# EAGLE design DC-DC Converter v1.1 (EAGLE 5.12)

## Sheet 1 of 3
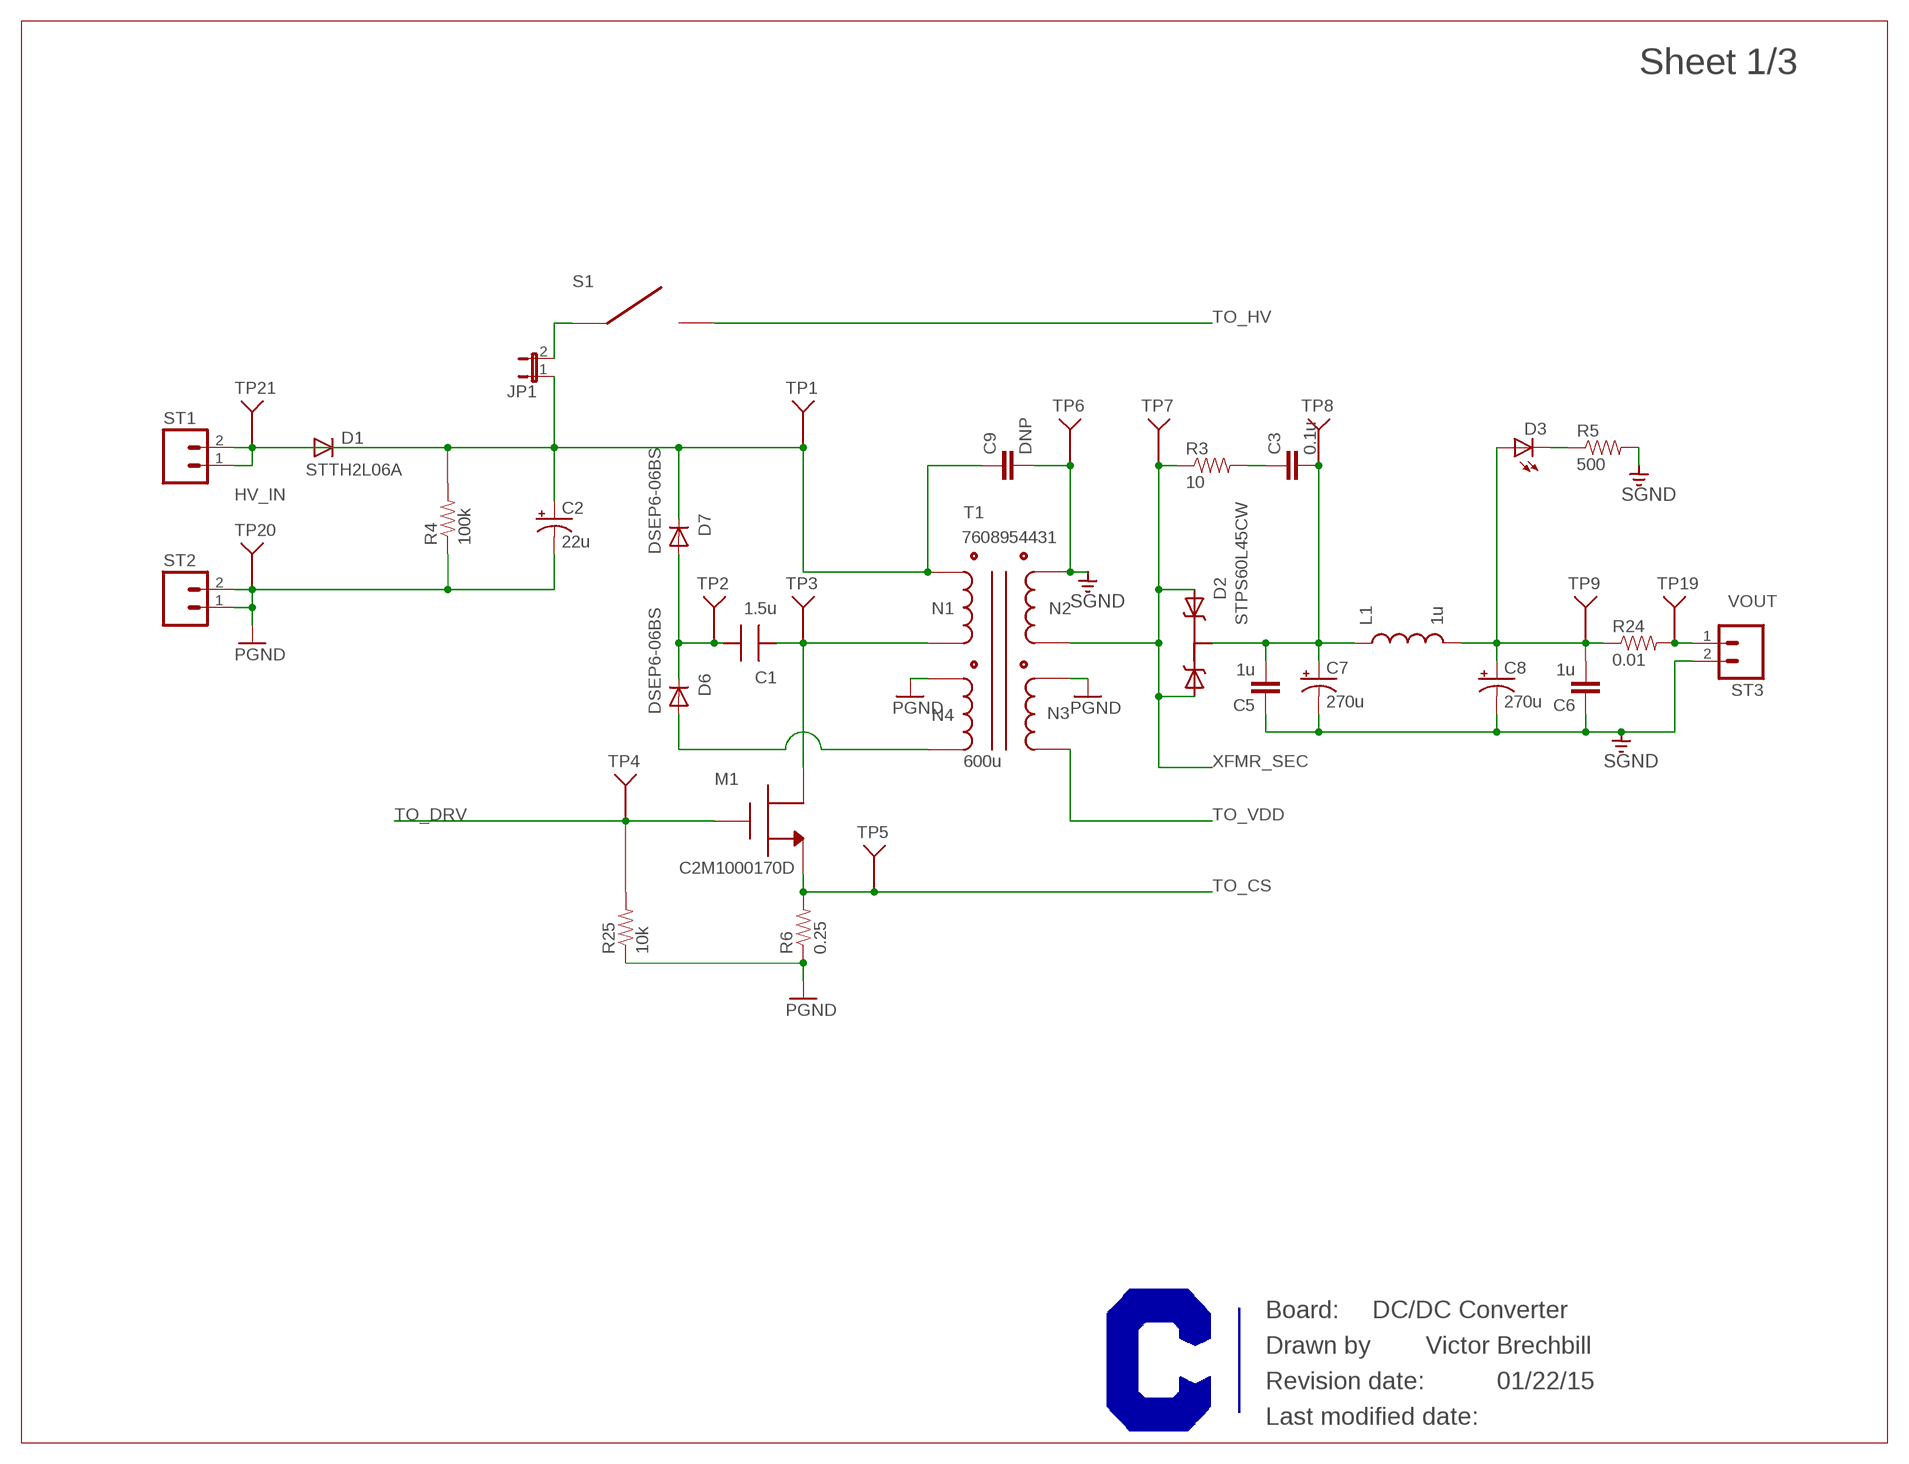
[diagram p0: schematic, sheet 1]

### Parts
C1  1.5u  CAP_CKG57XXX  [CKG_MEGACAP_57]
C2  22u  12.5MM_CAP  [12.5MM_CAP]
C3  0.1u  CAP0805  [0805]
C5  1u  CAP0805  [0805]
C6  1u  CAP0805  [0805]
C7  270u  8MM_CAP  [8MM_CAP]
C8  270u  8MM_CAP  [8MM_CAP]
C9  DNP  CAP0603-CAP  [0603-CAP]
D1  DIODEHV  [DIODE-HV]
D2  DUAL-DIODE_SINK  [T247_SINK]
D3  LEDCHIPLED_0805  [CHIPLED_0805]
D6  DIODESMB  [SMB-DIODE]
D7  DIODESMB  [SMB-DIODE]
JP1  JUMPER-2PTH  [1X02]
L1  1u  MCBF7330  [MCBF7330]
M1  N-MOSFET_SINK  [T247_SINK]
R3  10  RESISTOR2512  [R2512]
R4  100k  RESISTOR2512  [R2512]
R5  500  RESISTOR0603-RES  [0603-RES]
R6  0.25  RESISTOR1206  [1206]
R24  0.01  RESISTOR0805-RES  [0805]
R25  10k  RESISTOR2512  [R2512]
S1  SWITCH_15551  [15XXX]
ST1  M023.5MM-NO_SILK  [SCREWTERMINAL-3.5MM-2-NS]
ST2  M023.5MM-NO_SILK  [SCREWTERMINAL-3.5MM-2-NS]
ST3  M023.5MM-NO_SILK  [SCREWTERMINAL-3.5MM-2-NS]
T1  760895431  [ETD34]
TP1  TEST_POINT  [TEST_POINT]
TP2  TEST_POINT  [TEST_POINT]
TP3  TEST_POINT  [TEST_POINT]
TP4  TEST_POINT  [TEST_POINT]
TP5  TEST_POINT  [TEST_POINT]
TP6  TEST_POINT  [TEST_POINT]
TP7  TEST_POINT  [TEST_POINT]
TP8  TEST_POINT  [TEST_POINT]
TP9  TEST_POINT  [TEST_POINT]
TP19  TEST_POINT  [TEST_POINT]
TP20  TEST_POINT  [TEST_POINT]
TP21  TEST_POINT  [TEST_POINT]
U$2  CURRENT-C-LETTER-LANDSCAPE  [BLANK]

### Nets
D6: D3.C R5.1
FET_DRAIN: C1.P$1 M1.2(D) T1.P$2 TP3.P$1
FUSED: D1.A
HV_IN: ST1.1 ST1.2 TP21.P$1
N4: D6.A T1.P$6
OUT: R24.2 ST3.1 TP19.P$1
OUT_PREFILTER: C3.2 C5.2 C7.+ D2.2(OUT) L1.P$1 TP8.P$1
PGND: C2.- R4.1 R6.1 R25.1 ST2.1 ST2.2 T1.P$5 T1.P$9 TP20.P$1 ; also sheet 2
RVP_IN: C2.+ C9.1 D1.C D7.C JP1.1 R4.2 T1.P$4 TP1.P$1
SGND: C5.1 C6.1 C7.- C8.- C9.2 R5.2 ST3.2 T1.P$8 TP6.P$1 ; also sheet 3
SNUB_SEC: C3.1 R3.2
TO_CS: M1.3(S) R6.2 TP5.P$1 ; also sheet 2
TO_DRV: M1.1(G) R25.2 TP4.P$1 ; also sheet 2
TO_HV: S1.P$4 ; also sheet 2
TO_SW: JP1.2 S1.P$3
TO_VDD: T1.P$11 ; also sheet 2
V_SNUB: C1.P$2 D6.C D7.A TP2.P$1
VOUT: C6.2 C8.+ D3.A L1.P$2 R24.1 TP9.P$1 ; also sheet 3
XFMR_SEC: D2.1(IN_1) D2.3(IN_2) R3.1 T1.P$10 TP7.P$1 ; also sheet 3

### Notes on the sheet
- STTH2L06A
- 7608954431
- DSEP6-06BS
- STPS60L45CW
- DSEP6-06BS
- 600u
- C2M1000170D
- DC/DC Converter
- Victor Brechbill
- 01/22/15

## Sheet 2 of 3
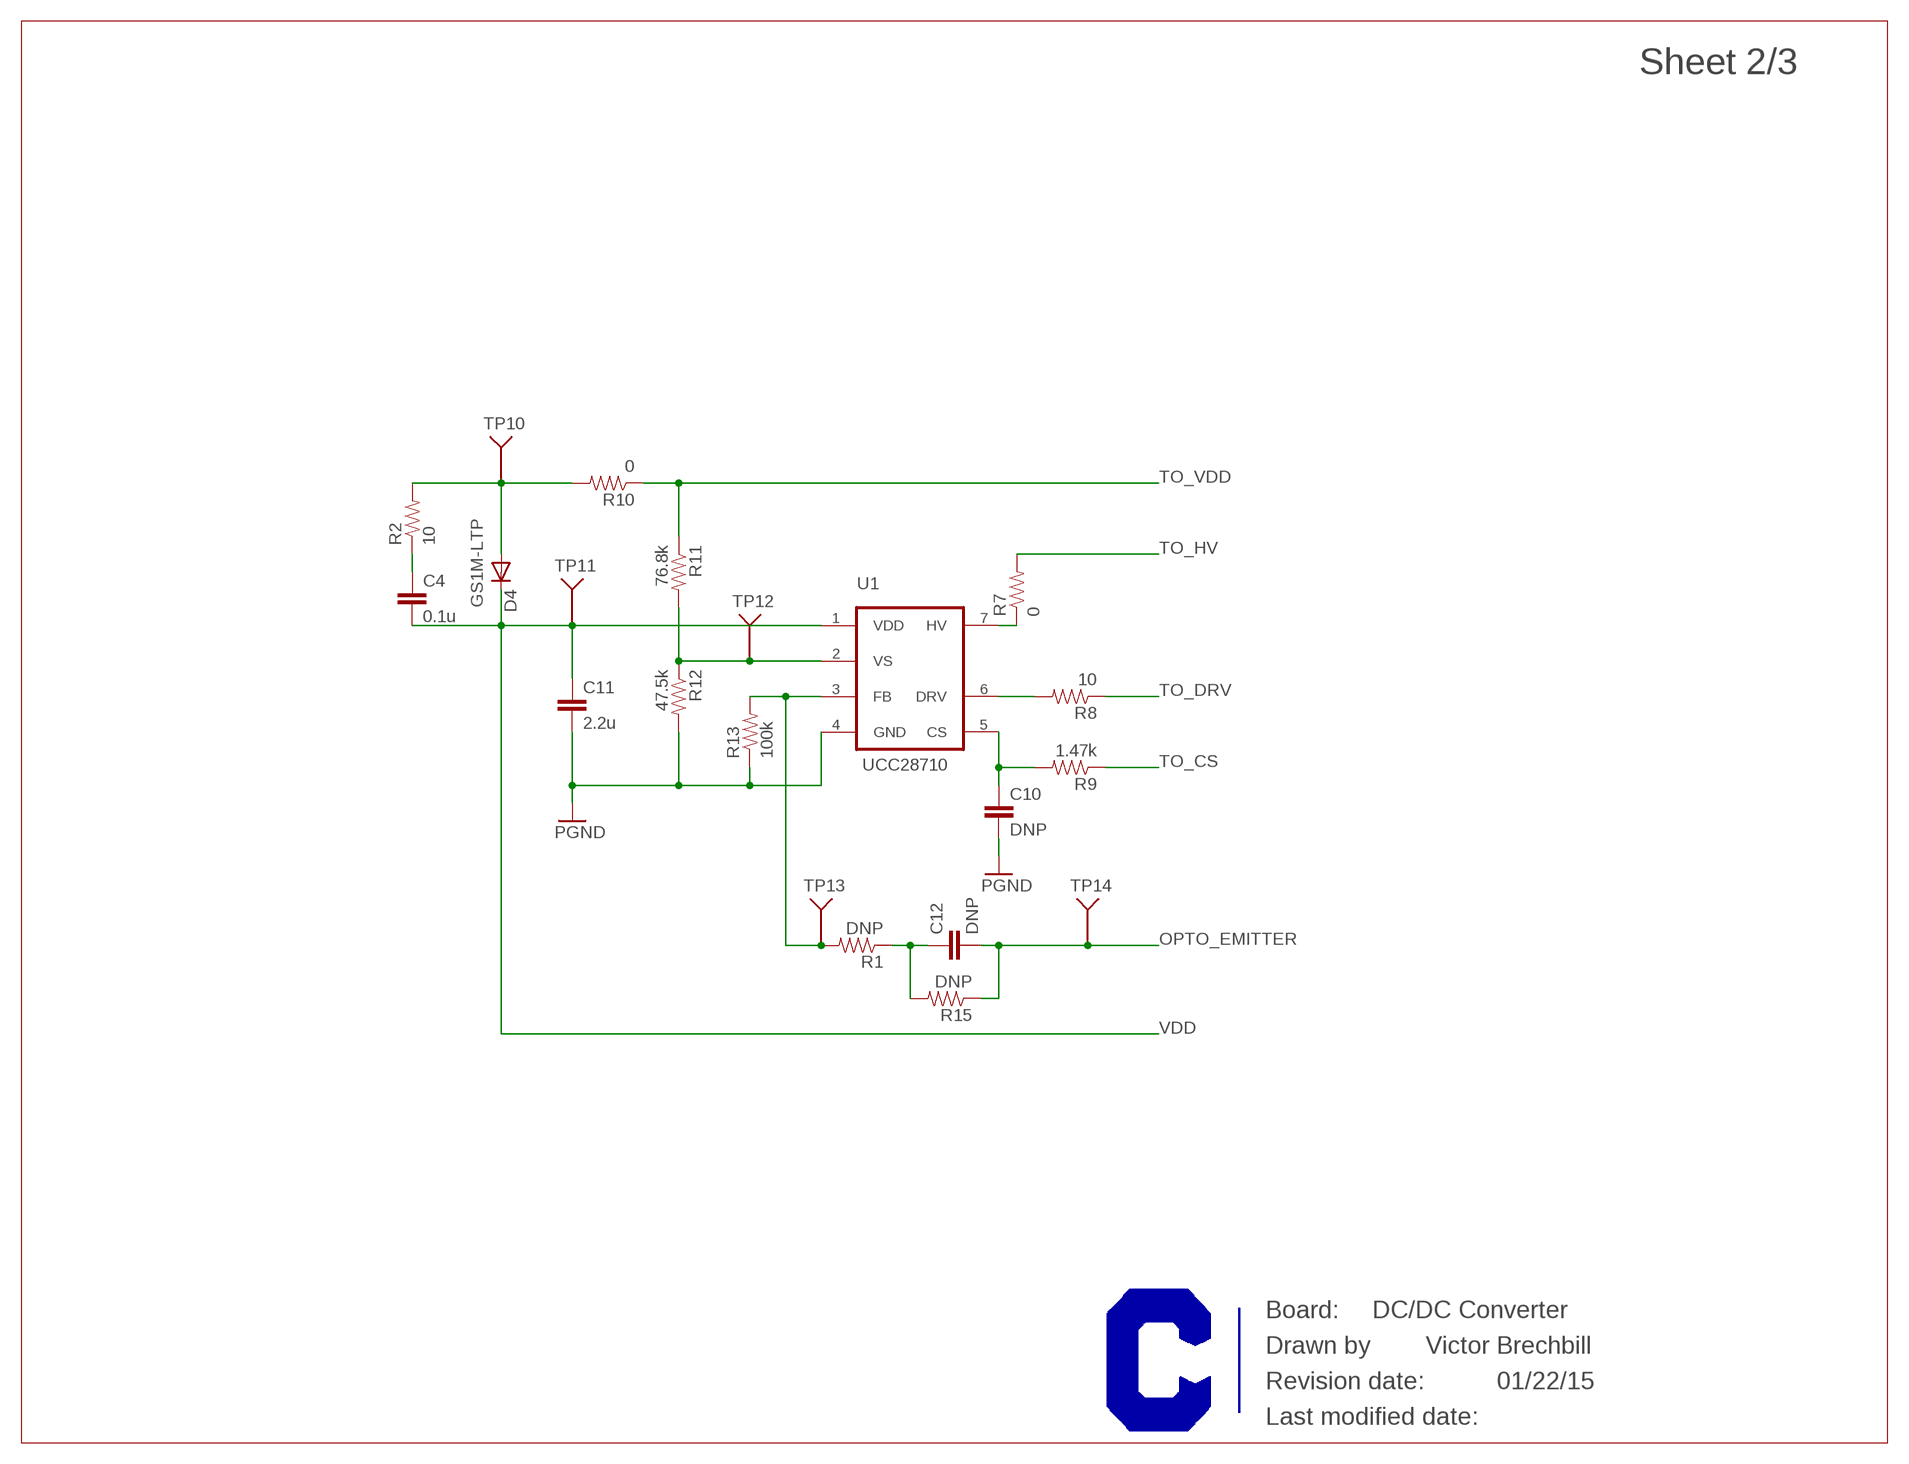
[diagram p1: schematic, sheet 2]

### Parts
C4  0.1u  CAP0805  [0805]
C10  DNP  CAP0603-CAP  [0603-CAP]
C11  2.2u  CAP0805  [0805]
C12  DNP  CAP0603-CAP  [0603-CAP]
D4  DIODESMA  [SMA-DIODE]
R1  DNP  RESISTOR0603-RES  [0603-RES]
R2  10  RESISTOR2512  [R2512]
R7  0  RESISTOR0805-RES  [0805]
R8  10  RESISTOR0805-RES  [0805]
R9  1.47k  RESISTOR0805-RES  [0805]
R10  0  RESISTOR0805-RES  [0805]
R11  76.8k  RESISTOR0805-RES  [0805]
R12  47.5k  RESISTOR0805-RES  [0805]
R13  100k  RESISTOR0603-RES  [0603-RES]
R15  DNP  RESISTOR0603-RES  [0603-RES]
TP10  TEST_POINT  [TEST_POINT]
TP11  TEST_POINT  [TEST_POINT]
TP12  TEST_POINT  [TEST_POINT]
TP13  TEST_POINT  [TEST_POINT]
TP14  TEST_POINT  [TEST_POINT]
U1  UCC28740  [SOIC-7]
U$3  CURRENT-C-LETTER-LANDSCAPE  [BLANK]

### Nets
CS: C10.1 R9.2 U1.5(CS)
DRV: R8.2 U1.6(DRV)
FB: R1.2 R13.2 TP13.P$1 U1.3(FB)
HV: R7.1 U1.7(HV)
N$5: C4.1 R2.1
N$6: D4.A R2.2 R10.2 TP10.P$1
N$9: C12.1 R1.1 R15.2
OPTO_EMITTER: C12.2 R15.1 TP14.P$1 ; also sheet 3
PGND: C10.2 C11.2 R12.2 R13.1 U1.4(GND) ; also sheet 1
TO_CS: R9.1 ; also sheet 1
TO_DRV: R8.1 ; also sheet 1
TO_HV: R7.2 ; also sheet 1
TO_VDD: R10.1 R11.1 ; also sheet 1
VDD: C4.2 C11.1 D4.C TP11.P$1 U1.1(VDD) ; also sheet 3
VS: R11.2 R12.1 TP12.P$1 U1.2(VS)

### Notes on the sheet
- GS1M-LTP
- UCC28710
- DC/DC Converter
- Victor Brechbill
- 01/22/15

## Sheet 3 of 3
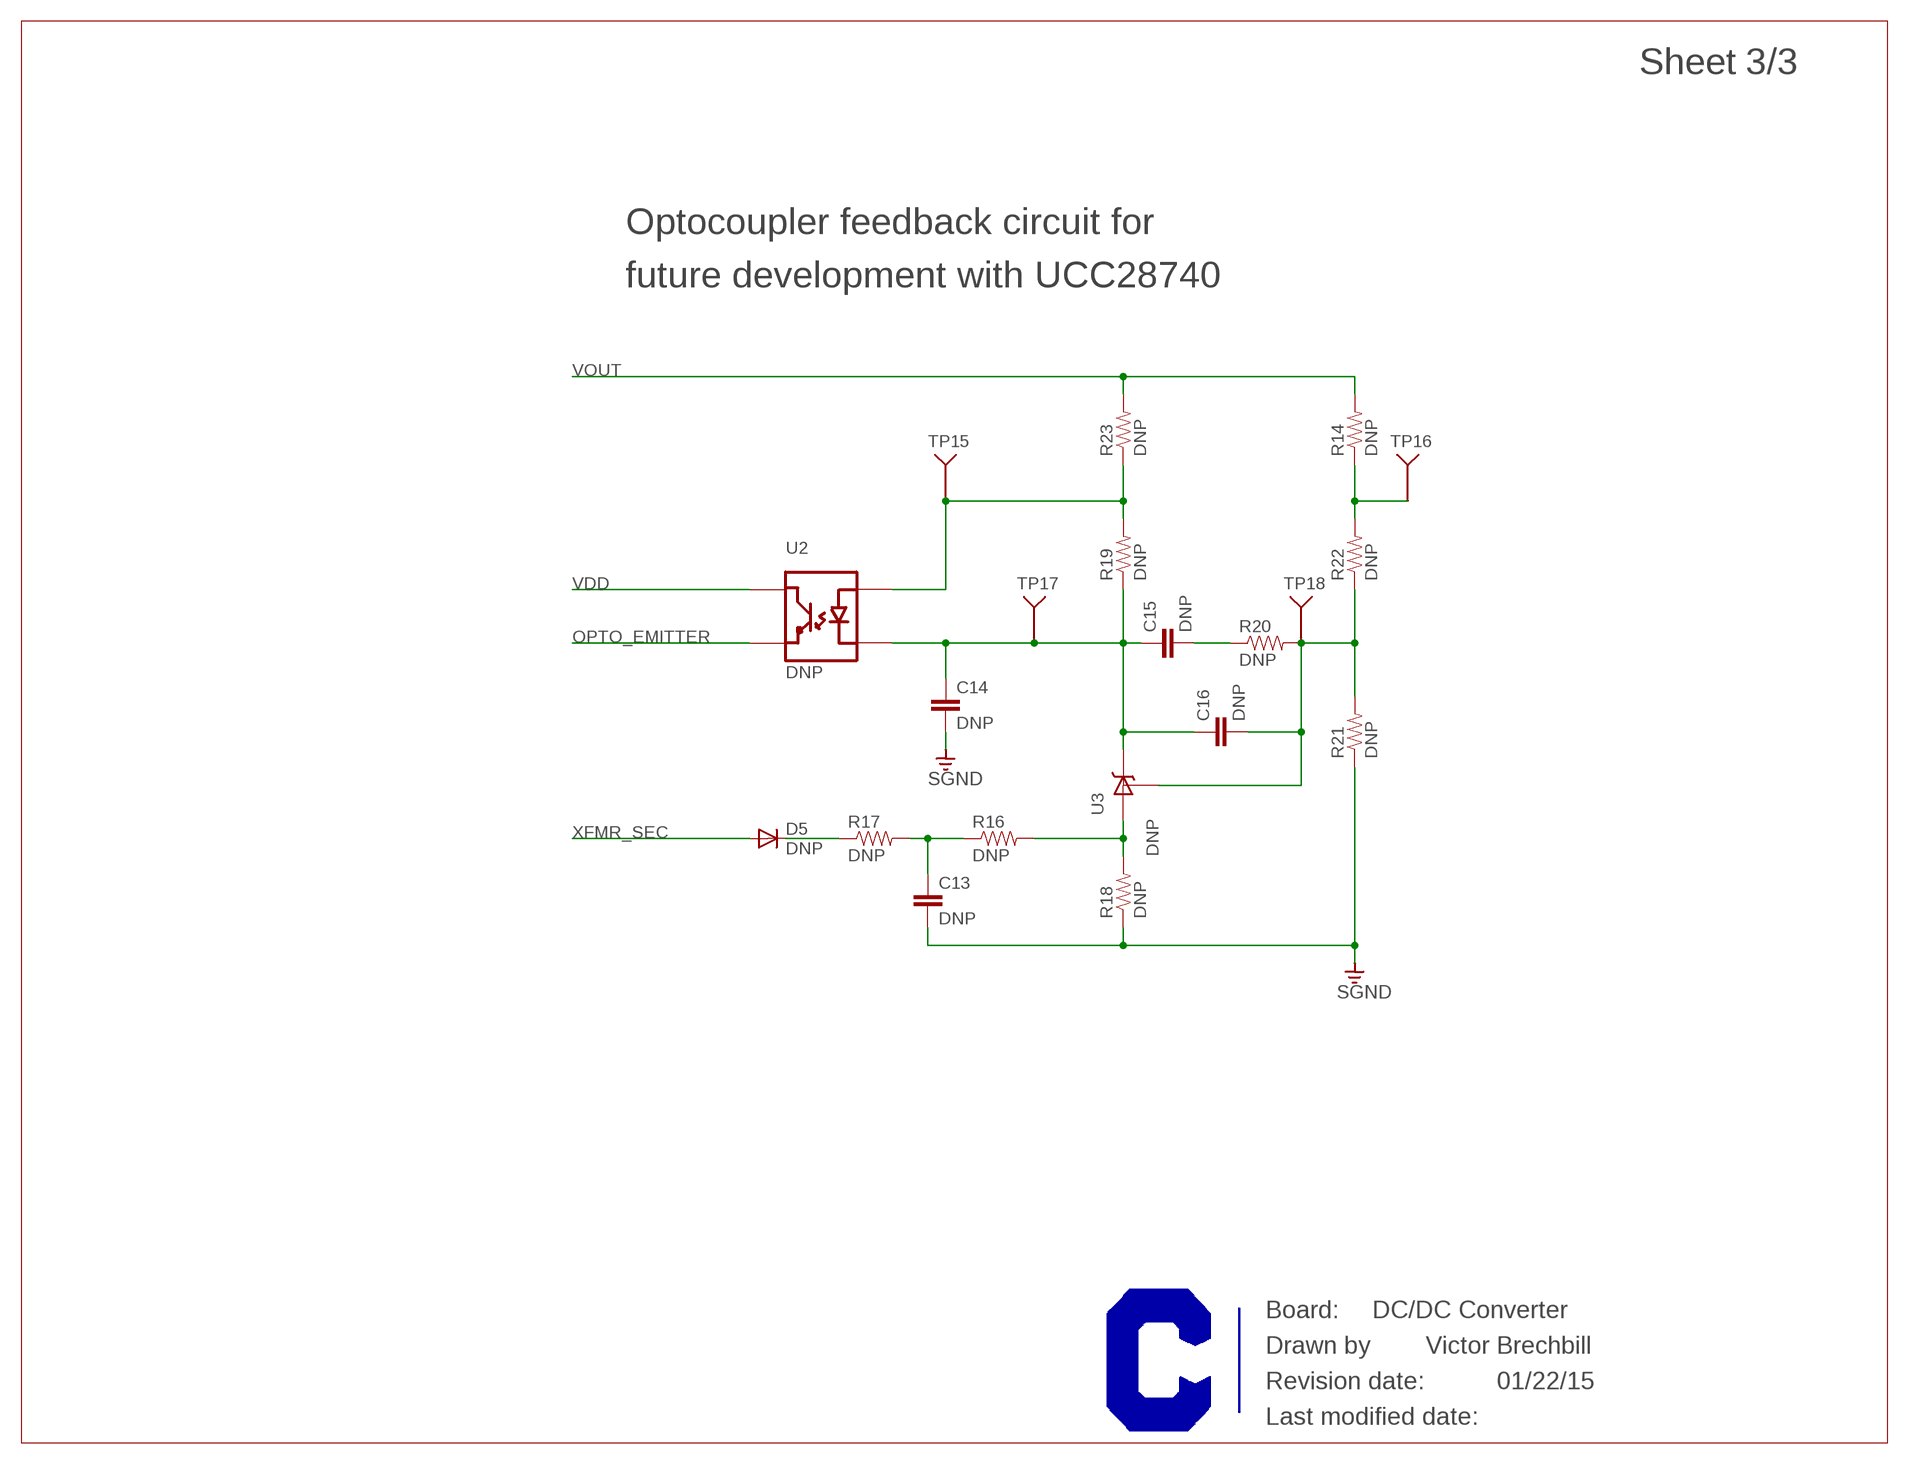
[diagram p2: schematic, sheet 3]

### Parts
C13  DNP  CAP0603-CAP  [0603-CAP]
C14  DNP  CAP0603-CAP  [0603-CAP]
C15  DNP  CAP0603-CAP  [0603-CAP]
C16  DNP  CAP0603-CAP  [0603-CAP]
D5  DNP  BAS16-7  [SOT-23]
R14  DNP  RESISTOR0603-RES  [0603-RES]
R16  DNP  RESISTOR0603-RES  [0603-RES]
R17  DNP  RESISTOR0603-RES  [0603-RES]
R18  DNP  RESISTOR0603-RES  [0603-RES]
R19  DNP  RESISTOR0603-RES  [0603-RES]
R20  DNP  RESISTOR0603-RES  [0603-RES]
R21  DNP  RESISTOR0603-RES  [0603-RES]
R22  DNP  RESISTOR0603-RES  [0603-RES]
R23  DNP  RESISTOR0603-RES  [0603-RES]
TP15  TEST_POINT  [TEST_POINT]
TP16  TEST_POINT  [TEST_POINT]
TP17  TEST_POINT  [TEST_POINT]
TP18  TEST_POINT  [TEST_POINT]
U2  DNP  LTV-817A  [LTV-817]
U3  DNP  TL431  [SOT-23]
U$4  CURRENT-C-LETTER-LANDSCAPE  [BLANK]

### Nets
N$1: C14.1 C15.1 C16.1 R19.1 TP17.P$1 U2.CATHODE U3.1(CATHODE)
N$2: C15.2 R20.1
N$3: C16.2 R20.2 R21.2 R22.1 TP18.P$1 U3.2(REF)
N$4: C13.1 R16.1 R17.2
N$7: D5.3(C) R17.1
N$8: R16.2 R18.2 U3.3(ANODE)
N$13: R19.2 R23.1 TP15.P$1 U2.ANODE
N$15: R14.1 R22.2 TP16.P$1
OPTO_EMITTER: U2.EMITTER ; also sheet 2
SGND: C13.2 C14.2 R18.1 R21.1 ; also sheet 1
VDD: U2.COLLECTOR ; also sheet 2
VOUT: R14.2 R23.2 ; also sheet 1
XFMR_SEC: D5.1(A) ; also sheet 1

### Notes on the sheet
- Optocoupler feedback circuit for
- future development with UCC28740
- DC/DC Converter
- Victor Brechbill
- 01/22/15

## Library data of the parts
C1 = Victor:CAP_CKG57XXX
C2 = Victor:12.5MM_CAP
C3-C6 C9-C16 = SparkFun:CAP: Capacitor Standard 0603 ceramic capacitor, and 0.1" leaded capacitor.
C7 C8 = Victor:8MM_CAP
D1 D4 D6 D7 = SparkFun:DIODE: Diode These are standard reverse protection diodes and small signal diodes. SMA package can handle up to about 1A. SOD-323 can handle about 200mA. What the SOD-323 package when ordering, there are some mfgs out there that are 5-pin packages.
D2 = Victor:DUAL-DIODE_SINK
D3 = led:LED: LED OSRAM: - CHIPLED LG R971, LG N971, LY N971, LG Q971, LY Q971, LO R971, LY R971 LH N974, LH R974 LS Q976, LO Q976, LY Q976 LO Q996 - Hyper CHIPLED LW Q18S LB Q993, LB Q99A, LB R99A - SideLED LS A670, LO A670, LY A670, LG A670, LP A670 LB A673, LV A673, LT A673, LW A673 LH A674 LY A675 LS A676, LA A676, LO A676, LY A676, LW A676 LS A679, LY A679, LG A679 - Hyper Micro SIDELED® LS Y876, LA Y876, LO Y876, LY Y876 LT Y87S - SmartLED LW L88C, LW L88S LB L89C, LB L89S, LG L890 LS L89K, LO L89K, LY L89K LS L896, LA L896, LO L896, LY L896 - TOPLED LS T670, LO T670, LY T670, LG T670, LP T670 LSG T670, LSP T670, LSY T670, LOP T670, LYG T670 LG T671, LOG T671, LSG T671 LB T673, LV T673, LT T673, LW T673 LH T674 LS T676, LA T676, LO T676, LY T676, LB T676, LH T676, LSB T676, LW T676 LB T67C, LV T67C, LT T67C, LS T67K, LO T67K, LY T67K, LW E67C LS E67B, LA E67B, LO E67B, LY E67B, LB E67C, LV E67C, LT E67C LW T67C LS T679, LY T679, LG T679 LS T770, LO T770, LY T770, LG T770, LP T770 LB T773, LV T773, LT T773, LW T773 LH T774 LS E675, LA E675, LY E675, LS T675 LS T776, LA T776, LO T776, LY T776, LB T776 LHGB T686 LT T68C, LB T68C - Hyper Mini TOPLED® LB M676 - Mini TOPLED Santana® LG M470 LS M47K, LO M47K, LY M47K Source: http://www.osram.convergy.de LUXEON: - LUMILED® LXK2-PW12-R00, LXK2-PW12-S00, LXK2-PW14-U00, LXK2-PW14-V00 LXK2-PM12-R00, LXK2-PM12-S00, LXK2-PM14-U00 LXK2-PE12-Q00, LXK2-PE12-R00, LXK2-PE12-S00, LXK2-PE14-T00, LXK2-PE14-U00 LXK2-PB12-K00, LXK2-PB12-L00, LXK2-PB12-M00, LXK2-PB14-N00, LXK2-PB14-P00, LXK2-PB14-Q00 LXK2-PR12-L00, LXK2-PR12-M00, LXK2-PR14-Q00, LXK2-PR14-R00 LXK2-PD12-Q00, LXK2-PD12-R00, LXK2-PD12-S00 LXK2-PH12-R00, LXK2-PH12-S00 LXK2-PL12-P00, LXK2-PL12-Q00, LXK2-PL12-R00 Source: www.luxeon.com KINGBRIGHT: KA-3528ASYC Source: www.kingbright.com
D5 = Victor:BAS16-7
JP1 = SparkFun:JUMPER-2: Jumper Basic 0.1" spaced jumper. Use with breakaway headers.
L1 = Victor:MCBF7330
M1 = Victor:N-MOSFET_SINK
R1-R25 = SparkFun:RESISTOR: Resistor Basic schematic elements and footprints for 0603, 1206, and PTH resistors.
S1 = Victor:SWITCH_15551: Unimec Switch P/N 15551
ST1-ST3 = SparkFun:M02: Header 2 Standard 2-pin 0.1" header. Use with straight break away headers (SKU : PRT-00116), right angle break away headers (PRT-00553), swiss pins (PRT-00743), machine pins (PRT-00117), and female headers (PRT-00115). Molex polarized connector foot print use with SKU : PRT-08233 with associated crimp pins and housings.
T1 = Victor:760895431
TP1-TP21 = Victor:TEST_POINT
U1 = TI:UCC28740
U2 = TI:LTV-817A
U3 = Victor:TL431
U$2-U$4 = Frames:CURRENT-C-LETTER-LANDSCAPE; BOM: EXCLUDE

## Board
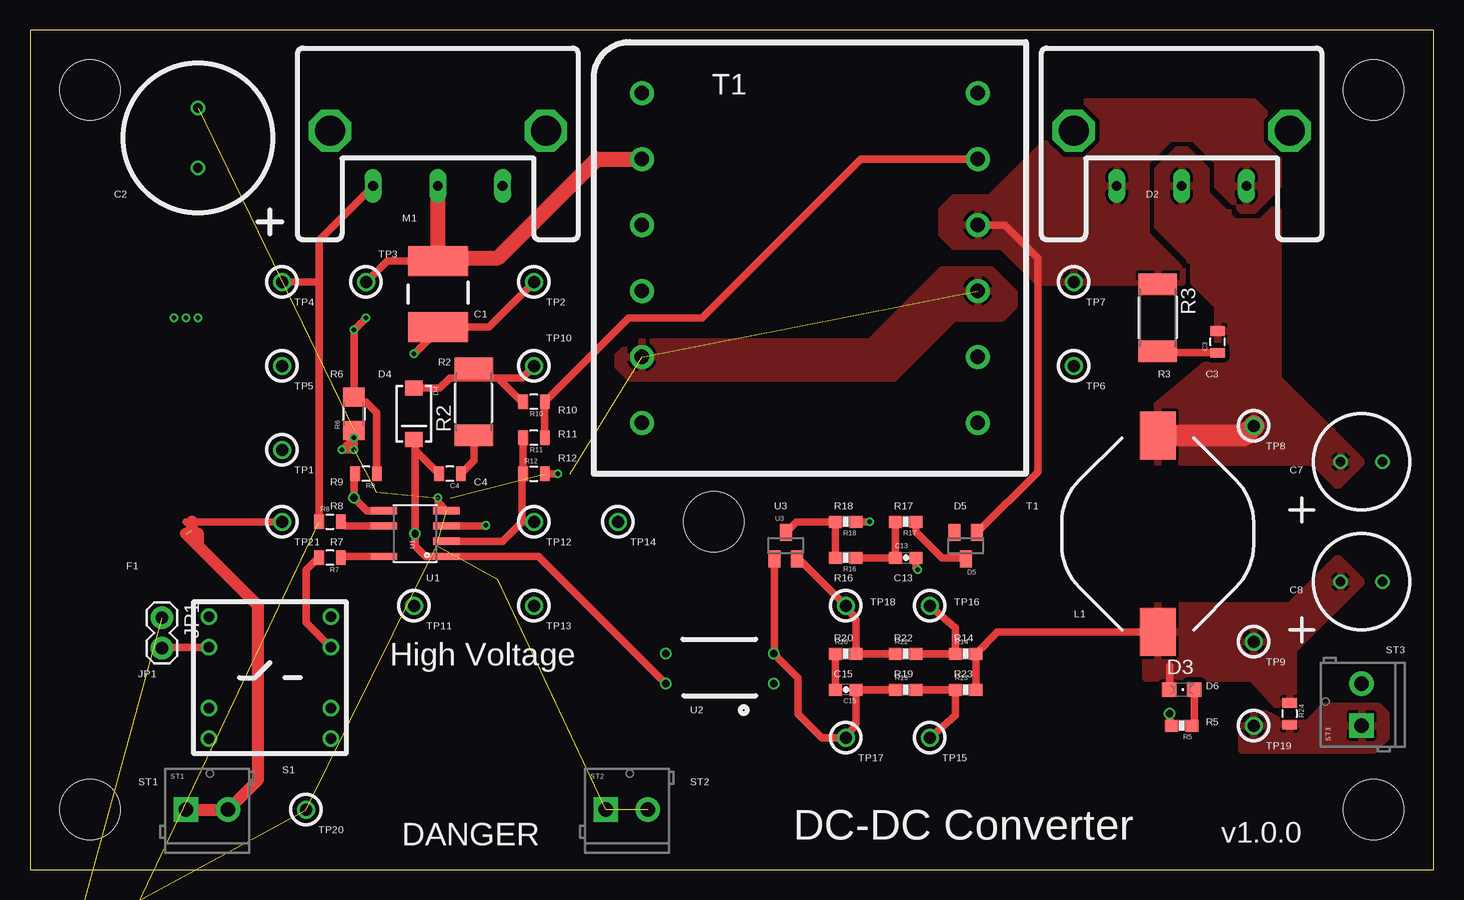
[diagram p3: board, top side]
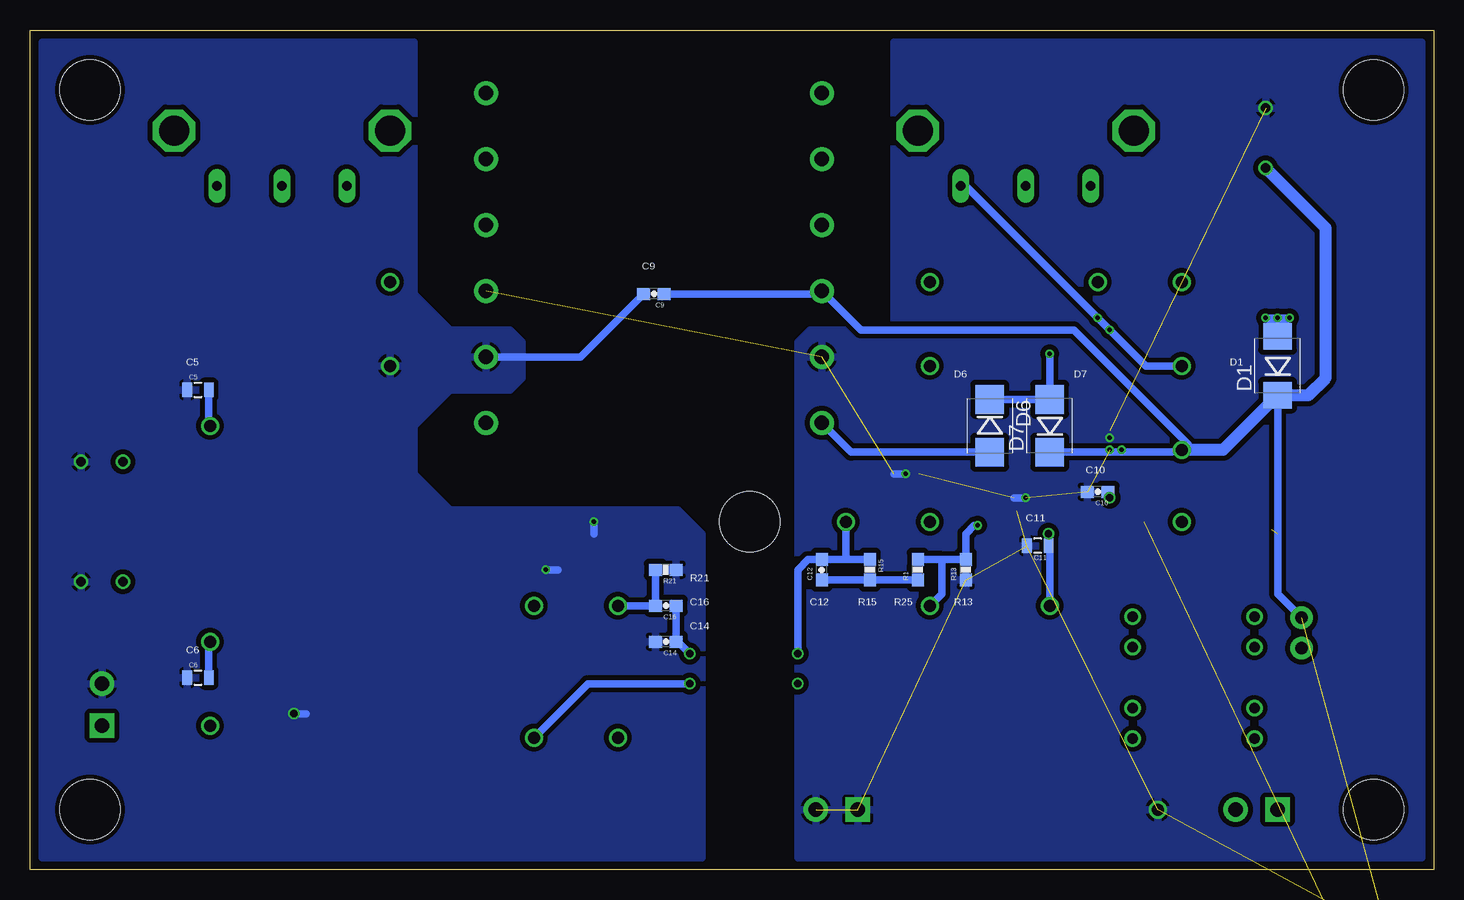
[diagram p4: board, bottom side, seen from below]

Size 117 x 70 mm. Coordinates in mm from the lower left corner, seen from the top.
Outline: 0,0 117,0 117,70 0,70 0,0
Copper layers (1*16): Top 0.0356mm / dielectric 1.5011mm / Bottom 0.0356mm
Design rules "OSH Park 2-layer": minimum track width 6mil, minimum drill 13mil, track to track 6mil, track to pad 6mil, pad to pad 6mil, via to via 6mil, smd to smd 6mil, copper to edge 15mil, drill to drill 6mil, minimum pad ring 7mil, minimum via ring 7mil, stop-mask expansion 4mil, vias tented up to drill 0mil, thermal gap 10mil
Holes 5 mm at 5,5 5,65 112,65 112,5 57,29

### Footprints (pad centres in the part's own frame; a part is rotated, then mirrored left to right if it is on the bottom)
CKG_MEGACAP_57 = smd 2.5 x 5: P$1 2.75,0; P$2 -2.75,0
12.5MM_CAP = drill 0.8 round: + 0,2.5; - 0,-2.5
0805 = smd 0.8 x 1.2: 1 -0.9,0; 2 0.9,0
8MM_CAP = drill 0.8 round: + 0,1.75; - 0,-1.75
0603-CAP = smd 1.1 x 1: 1 -0.85,0; 2 0.85,0
DIODE-HV = smd 2.2 x 2.4: A 2.454,0; C -2.454,0
T247_SINK = drill 0.8 pad 1.4 long: 1 -5.4,0; 2 0,0; 3 5.4,0 | drill 2.5 octagon: P$1 9,4.6; P$2 -9,4.6
CHIPLED_0805 = smd 1.2 x 1.2: A 0,-1.05; C 0,1.05
SMA-DIODE = smd 1.27 x 1.47: A -2.15,0; C 2.15,0
SOT-23 = smd 1 x 1.4: 1 -0.95,-1.1; 2 0.95,-1.1; 3 0,1.1
SMB-DIODE = smd 2.4 x 2.4: A 2.2,0; C -2.2,0
1X02 = drill 1.016 pad 1.88 round: 1 0,0; 2 2.54,0
MCBF7330 = smd 4 x 3: P$1 -8.2,0; P$2 8.2,0
0603-RES = smd 1.1 x 1: 1 -0.85,0; 2 0.85,0
R2512 = smd 1.8 x 3.2: 1 -2.8,0; 2 2.8,0
1206 = smd 1.6 x 1.8: 1 -1.4,0; 2 1.4,0
15XXX = drill 0.899 round: P$1 -5.08,5.08; P$2 5.08,5.08; P$3 -5.08,2.54; P$4 5.08,2.54; P$5 -5.08,-2.54; P$6 5.08,-2.54; P$7 -5.08,-5.08; P$8 5.08,-5.08
SCREWTERMINAL-3.5MM-2-NS = drill 1.2 pad 2.032 square: 1 0,0 | drill 1.2 pad 2.032 round: 2 3.5,0
ETD34 = drill 1.2 pad 2 round: P$1 -14,13.75; P$2 -14,8.25; P$3 -14,2.75; P$4 -14,-2.75; P$5 -14,-8.25; P$6 -14,-13.75; P$7 14,-13.75; P$8 14,-8.25; P$9 14,-2.75; P$10 14,2.75; P$11 14,8.25; P$12 14,13.75
TEST_POINT = drill 1 round: P$1 0,0
SOIC-7 = smd 0.61 x 2.21: 1 -1.895,-2.716; 2 -0.625,-2.716; 3 0.645,-2.716; 4 1.915,-2.716; 5 1.915,2.516; 6 0.645,2.516; 7 -1.895,2.516
LTV-817 = drill 0.6 round: ANODE 0,-4.5; CATHODE 2.5,-4.5; COLLECTOR 0,4.5; EMITTER 2.5,4.5

### Placement (x,y rotation side)
C1  34,48 90 top
C2  14,61 180 top
C3  99,44 90 top
C4  35,33 180 top
C5  103,40 0 bottom
C6  103,16 0 bottom
C7  111,34 90 top
C8  111,24 90 top
C9  65,48 180 bottom
C10  28,31.5 180 bottom
C11  33,27 180 bottom
C12  51,25 90 bottom
C13  73,26 0 top
C14  64,19 180 bottom
C15  68,15 180 top
C16  64,22 180 bottom
D1  13,42 90 bottom
D2  96,57 0 top
D3  96,15 270 top
D4  32,38 270 top
D5  78,27 180 top
D6  37,37 270 bottom
D7  32,37 90 bottom
JP1  11,21 270 top
L1  94,28 270 top
M1  34,57 0 top
R1  43,25 90 bottom
R2  37,39 90 top
R3  94,46 270 top
R4  0,-9 0 top  (outside the outline)
R5  96,12 180 top
R6  27,38 90 top
R7  25,26 180 top
R8  25,29 0 top
R9  28,33 180 top
R10  42,39 180 top
R11  42,36 180 top
R12  42,33 0 top
R13  39,25 90 bottom
R14  78,18 0 top
R15  47,25 270 bottom
R16  68,26 180 top
R17  73,29 180 top
R18  68,29 180 top
R19  73,15 0 top
R20  68,18 0 top
R21  64,25 180 bottom
R22  73,18 0 top
R23  78,15 0 top
R24  105,13 270 top
R25  -0.5,-17 0 top  (outside the outline)
S1  20,16 0 top
ST1  13,5 0 top
ST2  48,5 0 top
ST3  111,12 90 top
T1  65,51 0 top
TP1  21,35 0 top
TP2  42,49 0 top
TP3  28,49 0 top
TP4  21,49 0 top
TP5  21,42 0 top
TP6  87,42 0 top
TP7  87,49 0 top
TP8  102,37 0 top
TP9  102,19 0 top
TP10  42,42 0 top
TP11  32,22 0 top
TP12  42,29 0 top
TP13  42,22 0 top
TP14  49,29 0 top
TP15  75,11 0 top
TP16  75,22 0 top
TP17  68,11 0 top
TP18  68,22 0 top
TP19  102,12 0 top
TP20  23,5 0 top
TP21  21,29 0 top
U1  32,28 90 top
U2  57.5,15.5 90 top
U3  63,27 0 top
U$2  0,0 0 top
U$3  -1.5,-2 0 top
U$4  -3,-4 0 top  (outside the outline)

### Tracks (layer width: path | path; a pad name or v marks a point on that pad's centre or on a via)
CS  (via drill 0.6)
  Top 0.61: U1.5 28.09,29.91 v27,31 27,32.9 R9.2
  Bottom 0.61: C10.1 27.15,31.15 v27,31
D6
  Top 0.61: R5.1 97.05,12.2 D3.C
DRV
  Top 0.61: R8.2 26.25,28.64 U1.6
FB  (via drill 0.38)
  Top 0.61: U1.3 37.95,28.64 v38,28.7
  Bottom 0.61: 41,25.85 R13.2 39,28 38.3,28.7 v38,28.7 | 41,25.85 R1.2 | TP13.P$1 41,23 41,25.85
FET_DRAIN
  Top 0.61: C1.P$1 29.75,50.75 TP3.P$1
  Top 1.27: M1.2 C1.P$1 34.25,51 39,51 47.25,59.25 T1.P$2
FUSED  (via drill 0.38)
  Bottom 0.61: D1.A v13,46
HV
  Top 0.61: R7.1 26,26.11 U1.7
HV_IN  (1 unrouted)
  Top 0.61: 13,29 13.5,29 TP21.P$1
  Top 1.016: ST1.1 ST1.2 19,7.5 19,22 14,27 | 14,27 13,28 14,28 14,27 | 13.5,28.3 13.5,29
N4
  Bottom 0.61: T1.P$6 48.55,34.8 D6.A
N$1
  Top 0.61: R19.1 C15.1 68.85,12.15 TP17.P$1 66,11 64,13 64,16 U2.CATHODE 62.05,18.05 U3.1
  Bottom 0.61: C16.1 C14.1 63,19 U2.CATHODE
N$2
  Top 0.61: C15.2 R20.1
N$3
  Top 0.61: R22.1 R20.2 68.85,20.85 TP18.P$1 | U3.2 64.1,25.9 TP18.P$1 | TP18.P$1 68.1,22.1
  Bottom 0.61: TP18.P$1 C16.2 R21.2
N$4
  Top 0.61: R17.2 C13.1 R16.1
N$5
  Top 0.61: C4.1 37,34.1 R2.1
N$6
  Top 0.61: R10.2 41,39 39,41 | 37.8,41 39,41 | 37.8,41 R2.2 | D4.A 34.15,40.15 35,41 37.8,41 | TP10.P$1 41,41 39,41
N$7
  Top 0.61: R17.1 73.85,28.15 76,26 77.9,26 D5.3
N$8
  Top 0.61: 62.9,28 U3.3 63.9,29 R18.2 R16.2
N$9
  Bottom 0.61: R1.1 R15.2 C12.1
N$12  (via drill 0.38)
  Bottom 0.61: v12,46 v14,46 12.7,46 12.3,45.6 13.6,45.6
N$13
  Top 0.61: TP15.P$1 77.15,12.85 R23.1 R19.2
  Bottom 0.61: U2.ANODE 70.5,15.5 TP15.P$1
N$15
  Top 0.61: R22.2 R14.1 77.15,20.15 TP16.P$1
OPTO_EMITTER
  Bottom 0.61: 49,25.85 C12.2 52.15,25.85 53,25 U2.EMITTER | 49,25.85 R15.1 | 49,25.85 TP14.P$1
OUT
  pour Top (isolate 0.406, rank 2): 105,12 105.2,12.2 106.5,12.2 107.9,13.6 112.4,13.6 113,13 113,11 112,10 101,10 101,13 103,13
OUT_PREFILTER
  Top 1.778: L1.P$1 101.2,36.2 TP8.P$1
  Bottom 0.61: C5.2 102.1,37.1 TP8.P$1
  pour Top (isolate 0.406, rank 2): 93,59 95,61 97,61 99,59 99,57 101,55 104,55 104,39 100,34 93,34 93,38 99,43 99,47 93,53
  pour Top: 104,41 111,34 109,32 107,34 100,34
PGND  (via drill 0.38)  (13 unrouted)
  Top 0.61: U1.4 34,30.63 v34,31 | v27,36 R6.1 | v27,36 v27,35 v26,35 v27,36 | R12.2 v44,33
  Bottom 0.61: v34,31 35,31 | v44,33 45,33
  pour Bottom (isolate 0.406): 1,69 45,69 45,45 52,45 53,44 53,1 1,1
  pour Top (isolate 1.016, rank 3): 49,43 49,42 50,41 72,41 77,46 81,46 82,47 82,49 81,50 76,50 70,44 50,44
RVP_IN  (1 unrouted)
  Bottom 0.61: C9.1 51.25,48 T1.P$4 47.75,45 30,45 20.45,35.45 20.55,35.45 TP1.P$1 21.8,34.8 D7.C | JP1.1 13,23 D1.C
  Bottom 1.016: C2.+ 9,53.5 9,41 10.45,39.55 D1.C 17.55,35 TP1.P$1
SGND  (via drill 0.38, 0.6)
  Top 0.61: R5.2 95,12.15 v95,13 | R18.1 v70,29 | C13.2 73.85,25.15 v74,25
  Bottom 0.61: T1.P$8 71.1,42.75 C9.2 | v95,13 94,13 | v70,29 70,28 | 73,25 v74,25
  pour Bottom (isolate 0.406): 85,69 116,69 116,1 85,1
  pour Bottom: 85,48 82,45 77,45 76,44 76,41 77,40 82,40 85,37
  pour Bottom (isolate 0.406): 85,33 82,30 63,30 61,28 61,1 85,1
SNUB_SEC
  Top 0.61: C3.1 94.1,43.1 R3.2
TO_CS  (via drill 0.38)
  Top 0.61: R9.1 28.9,38.1 28,39 27.4,39 R6.2 v27,45 v28,46
  Bottom 0.61: M1.3 39,57 v28,46 v27,45 24,42 TP5.P$1
TO_DRV  (1 unrouted)
  Top 0.61: R8.1 24.1,49 | 24.1,49 24.1,52.5 M1.1 | 24.1,49 TP4.P$1
TO_HV
  Top 0.61: S1.P$4 23,20.62 23,25 24,26 R7.2
TO_SW
  Top 0.61: S1.P$3 11.08,18.54 JP1.2
TO_VDD
  Top 0.61: R11.1 R10.1 49.9,46 56,46 69.25,59.25 T1.P$11
V_SNUB  (via drill 0.38)
  Top 0.61: v32,43 34,45 C1.P$2 38.25,45.25 TP2.P$1
  Bottom 0.61: v32,43 D7.A D6.C
VDD  (via drill 0.6)
  Top 0.61: D4.C 32.1,35.75 32.1,35 | 32.1,35 v32.1,28 C11.1 32.99,26.11 U1.1 42.4,26.11 U2.COLLECTOR | 32.1,35 C4.2
  Bottom 0.61: v32.1,28 C11.1 32,26.9 TP11.P$1
VOUT
  Top 0.61: D3.A 95,15.05 95,17 | R23.2 R14.2 80.65,19.8 L1.P$2
  Bottom 0.61: C6.2 102.1,18.9 TP9.P$1
  pour Top (isolate 0.406): 93,22 100,22 105.3,16.7 105.3,13.8 104,13.6 100,18 93,18
  pour Top (isolate 0.406): 100,22 105,22 109,26 111,24 105.3,18.3 105.3,16.6 100,21.9
  pour Top (isolate 0.406): 93,19 93,16 102,16 99,19
VS
  Top 0.61: R11.2 R12.1 41,32.9 41,29 | U1.2 39.38,27.38 41,29 | 41,29 TP12.P$1
XFMR_SEC
  Top 0.61: D5.1 84,33.15 84,51 81.25,53.75 T1.P$10
  pour Top (isolate 0.406): 76,53 76,55 77,56 80,56 88,64 102,64 104,62 104,57 102,55 101,55 99,57 99,59 97,61 95,61 93,59 93,53 96,50 96,49 84,49 81,52 77,52

### Text on the board
_tsilk: C2 | D2 | M1 | TP3 | TP4 | TP2 | TP7 | C1 | TP10 | R2 | R6 | D4 | R3 | C3 | TP5 | TP6 | R10 | R11 | TP8 | R12 | TP1 | C7 | R9 | C4 | R8 | U3 | R18 | R17 | D5 | T1 | TP21 | R7 | TP12 | TP14 | F1 | U1 | R16 | C13 | C8 | TP18 | TP16 | L1 | TP11 | TP13 | R20 | R22 | R14 | ST3 | High Voltage | TP9 | JP1 | C15 | R19 | R23 | D6 | U2 | R5 | TP19 | TP17 | TP15 | S1 | ST1 | ST2 | DC-DC Converter | v1.0.0 | TP20 | DANGER
_bsilk: C9 | D1 | C5 | D7 | D6 | C10 | C11 | R21 | R13 | R25 | R15 | C12 | C16 | C14 | C6